# EAGLE design pc_kalam (EAGLE 6.4)
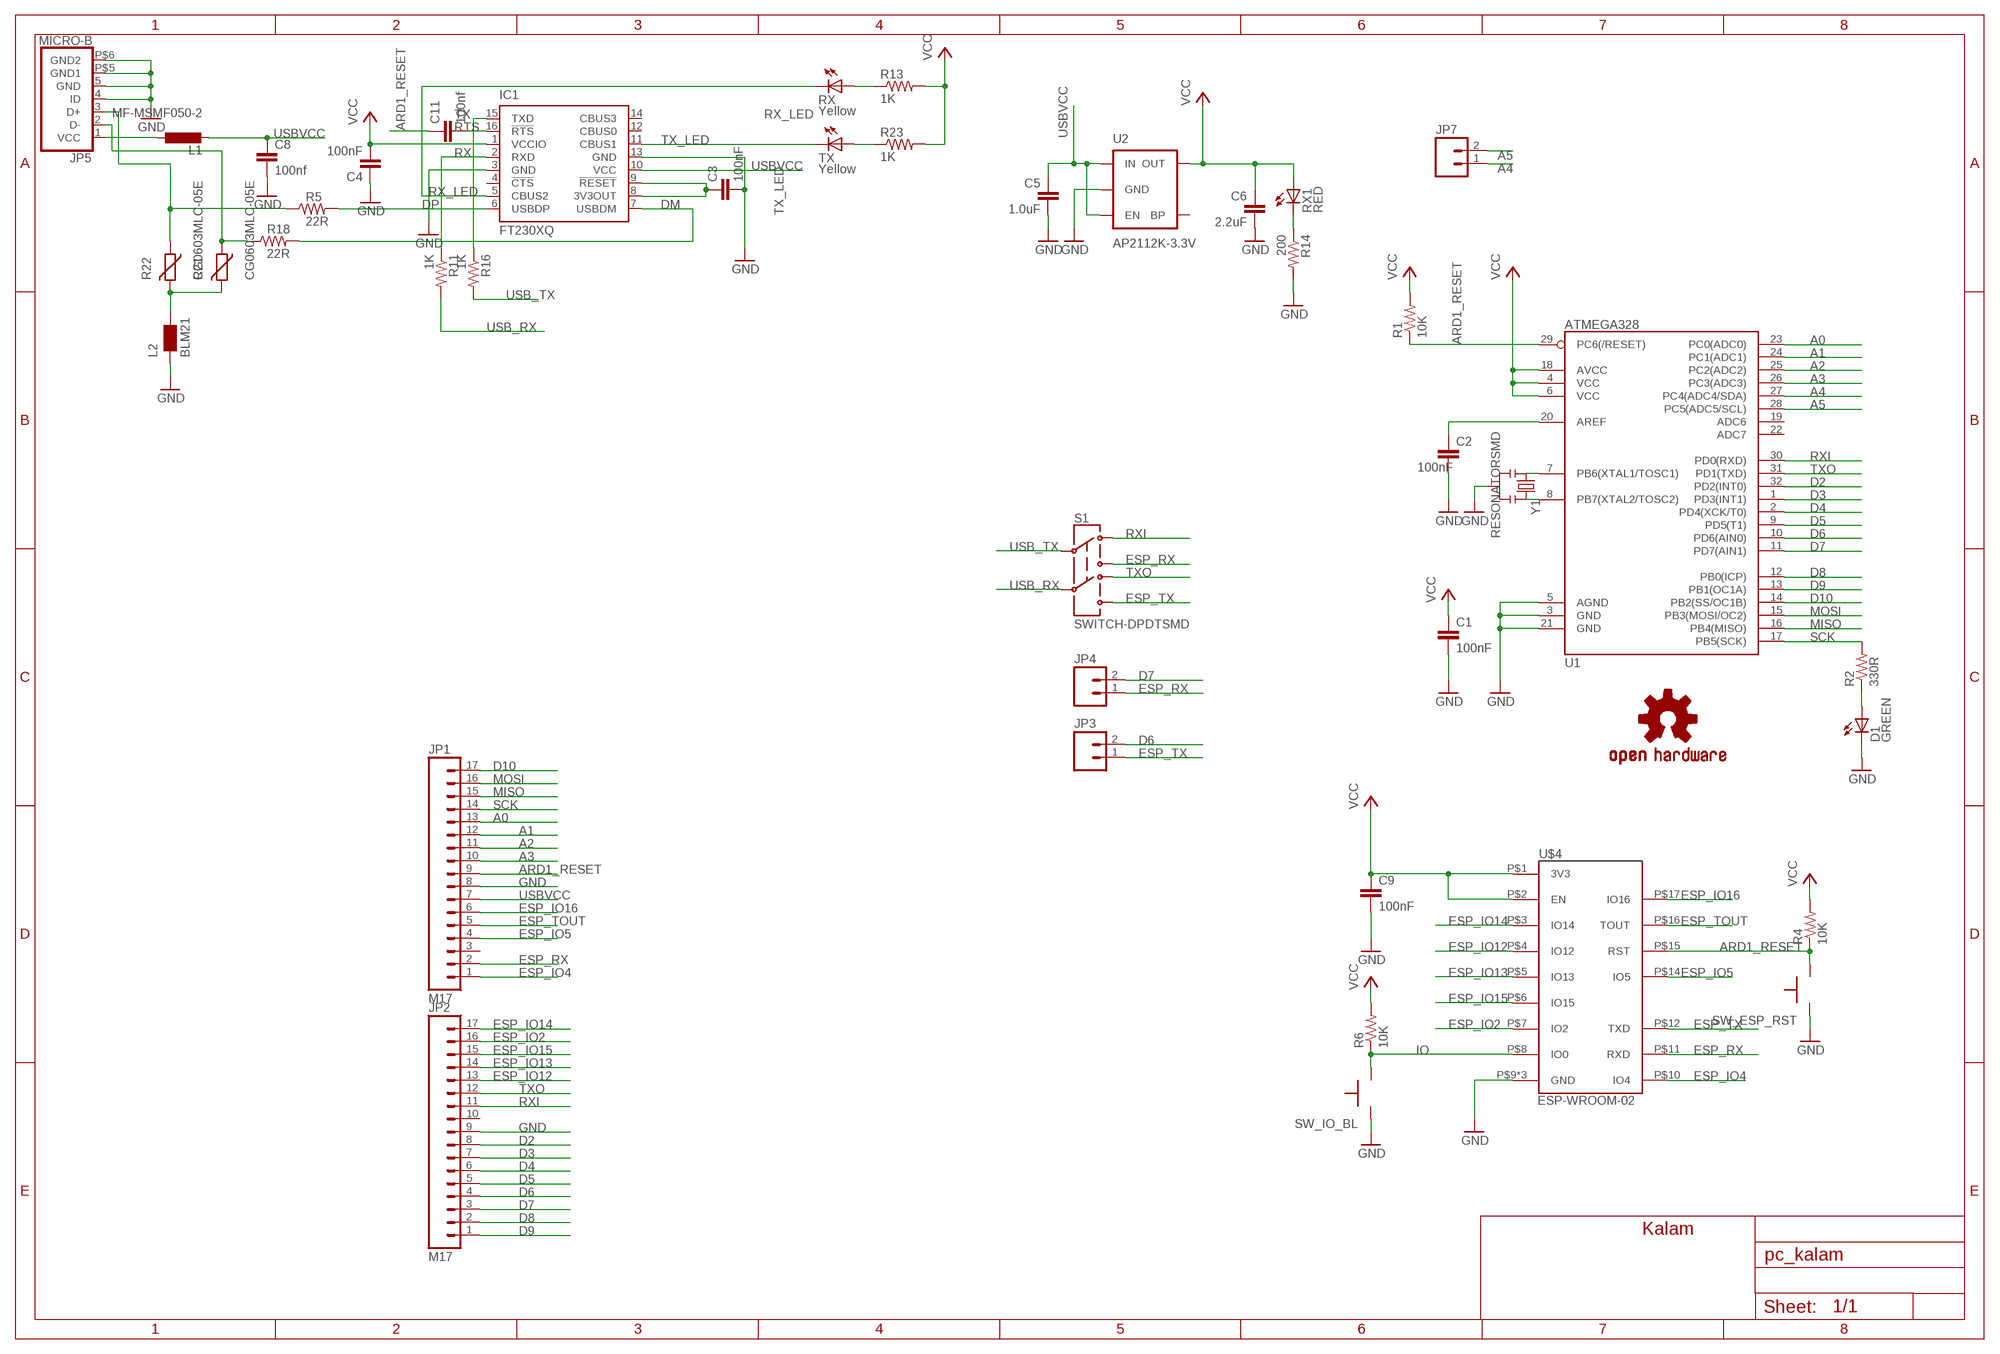
[diagram p0: schematic, sheet 1]

## Parts
C1  100nF  C-EUC0402  [C0402]
C2  100nF  C-EUC0402  [C0402]
C3  100nF  C-EUC0805  [C0805]
C4  100nF  C-EUC0805  [C0805]
C5  1.0uF  1.0UF-25V-+80/-20(0805)  [0805]
C6  2.2uF  C-EUC0805  [C0805]
C8  100nf  C-EUC0805  [C0805]
C9  100nF  C-EUC0402  [C0402]
C11  100nf  C-EUC0805  [C0805]
D1  GREEN  LED0603  [LED-0603]
IC1  FT230XQ  [QFN16]
JP1  M17  [1X17]
JP2  M17  [1X17]
JP3  M02PTH  [1X02]
JP4  M02PTH  [1X02]
JP5  MICRO-B  [MICRO-B]
JP7  M02PTH  [1X02]
L1  MF-MSMF050-2  L-EUL1812  [L1812]
L2  BLM21  WE-CBF_0805  [0805]
R1  10K  R-US_R0402  [R0402]
R2  330R  R-US_R0402  [R0402]
R4  10K  R-US_R0402  [R0402]
R5  22R  R-US_R0805  [R0805]
R6  10K  R-US_R0402  [R0402]
R11  1K  R-US_R0805  [R0805]
R13  1K  R-US_R0805  [R0805]
R14  200  R-US_R0805  [R0805]
R16  1K  R-US_R0805  [R0805]
R18  22R  R-US_R0805  [R0805]
R21  CG0603MLC-05E  VARISTORCN0603  [CT/CN0603]
R22  CG0603MLC-05E  VARISTORCN0603  [CT/CN0603]
R23  1K  R-US_R0805  [R0805]
RX  Yellow  LEDCHIPLED_0603  [CHIPLED_0603]
RX1  RED  LEDCHIPLED_0603  [CHIPLED_0603]
S1  SWITCH-DPDTSMD  [AYZ0202]
SW_ESP_RST  B3U-1000P  [B3U-1000P]
SW_IO_BL  B3U-1000P  [B3U-1000P]
TX  Yellow  LEDCHIPLED_0603  [CHIPLED_0603]
U1  ATMEGA328  ATMEGA168  [TQFP32-08]
U2  AP2112K-3.3V  V_REG_LDOSMD  [SOT23-5]
U$1  OSHW-LOGOS  [OSHW-LOGO-S]
U$2  PROTY-LOGO  [LOGO-PROTY]
U$3  PROTY-LOGO  [LOGO-PROTY]
U$4  ESP-WROOM-02  [ESP-WROOM-02]
U$5  KALAM  [KALAM]
Y1  RESONATORSMD  [RESONATOR-SMD]

## Nets
A0: JP1.13 U1.23(PC0(ADC0))
A1: JP1.12 U1.24(PC1(ADC1))
A2: JP1.11 U1.25(PC2(ADC2))
A3: JP1.10 U1.26(PC3(ADC3))
A4: JP7.1 U1.27(PC4(ADC4/SDA))
A5: JP7.2 U1.28(PC5(ADC5/SCL))
ARD1_RESET: C11.1 JP1.9 R1.1 R4.1 SW_ESP_RST.P$2 U1.29(PC6(/RESET)) U$4.P$15(RST)
D2: JP2.8 U1.32(PD2(INT0))
D3: JP2.7 U1.1(PD3(INT1))
D4: JP2.6 U1.2(PD4(XCK/T0))
D5: JP2.5 U1.9(PD5(T1))
D6: JP2.4 JP3.2 U1.10(PD6(AIN0))
D7: JP2.3 JP4.2 U1.11(PD7(AIN1))
D8: JP2.2 U1.12(PB0(ICP))
D9: JP2.1 U1.13(PB1(OC1A))
D10: JP1.17 U1.14(PB2(SS/OC1B))
DM: IC1.7(USBDM) R18.2
DP: IC1.6(USBDP) R5.2
ESP_IO2: JP2.16 U$4.P$7(IO2)
ESP_IO4: JP1.1 U$4.P$10(IO4)
ESP_IO5: JP1.4 U$4.P$14(IO5)
ESP_IO12: JP2.13 U$4.P$4(IO12)
ESP_IO13: JP2.14 U$4.P$5(IO13)
ESP_IO14: JP2.17 U$4.P$3(IO14)
ESP_IO15: JP2.15 U$4.P$6(IO15)
ESP_IO16: JP1.6 U$4.P$17(IO16)
ESP_RX: JP1.2 JP4.1 S1.3 U$4.P$11(RXD)
ESP_TOUT: JP1.5 U$4.P$16(TOUT)
ESP_TX: JP3.1 S1.6 U$4.P$12(TXD)
GND: C1.2 C2.2 C3.2 C4.1 C5.2 C6.2 C8.2 C9.2 D1.C IC1.3(GND) IC1.13(GND) JP1.8 JP2.9 JP5.4(ID) JP5.5(GND) JP5.P$5(GND1) JP5.P$6(GND2) L2.1 R14.2 SW_ESP_RST.P$1 SW_IO_BL.P$1 U1.3(GND) U1.5(AGND) U1.21(GND) U2.2(GND) U$4.P$9(GND) U$4.P$13(GND) U$4.P$18(GND) Y1.2
IO: R6.1 SW_IO_BL.P$2 U$4.P$8(IO0)
MISO: JP1.15 U1.16(PB4(MISO))
MOSI: JP1.16 U1.15(PB3(MOSI/OC2))
N$1: C2.1 U1.20(AREF)
N$2: U1.8(PB7(XTAL2/TOSC2)) Y1.3
N$3: U1.7(PB6(XTAL1/TOSC1)) Y1.1
N$4: C3.1 IC1.8(3V3OUT) IC1.9(!RESET)
N$7: R14.1 RX1.C
N$8: D1.A R2.1
N$16: JP5.2(D-) R18.1 R21.1
N$18: JP5.1(VCC) L1.1
N$40: R13.1 RX.A
N$41: R23.1 TX.A
N$64: L2.2 R21.2 R22.2
N$73: JP5.3(D+) R5.1 R22.1
RTS: C11.2 IC1.16(!RTS)
RX: IC1.2(RXD) R11.1
RX_LED: IC1.5(CBUS2) RX.C
RXI: JP2.11 S1.1 U1.30(PD0(RXD))
SCK: JP1.14 R2.2 U1.17(PB5(SCK))
TX: IC1.15(TXD) R16.1
TX_LED: IC1.11(CBUS1) TX.C
TXO: JP2.12 S1.4 U1.31(PD1(TXD))
USB_RX: R11.2 S1.5
USB_TX: R16.2 S1.2
USBVCC: C5.1 C8.1 IC1.10(VCC) JP1.7 L1.2 U2.1(IN) U2.3(EN)
VCC: C1.1 C4.2 C6.1 C9.1 IC1.1(VCCIO) R1.2 R4.2 R6.2 R13.2 R23.2 RX1.A U1.4(VCC) U1.6(VCC) U1.18(AVCC) U2.5(OUT) U$4.P$1(3V3) U$4.P$2(EN)
Unconnected: IC1.4(!CTS) IC1.12(CBUS0) IC1.14(CBUS3) JP1.3 JP2.10 U1.19(ADC6) U1.22(ADC7) U2.4(BP)

## Library data of the parts
C1-C4 C6 C8 C9 C11 = rcl:C-EU: CAPACITOR, European symbol
C5 = SparkFun-Capacitors:1.0UF-25V-+80/-20(0805): CAP-11625; PROD_ID: CAP-11625
D1 = SparkFun:LED: LEDs Standard schematic elements and footprints for 5mm, 3mm, 1206, and 0603 sized LEDs. 5mm - Spark Fun Electronics SKU : COM-00529 (and others)
IC1 = ftdichip:FT230X: USB to BASIC UART IC Auto generated by make-symbol-device-package-bsdl.ulp Rev. 43 Source: Data sheet <http://www.ftdichip.com/Support/Documents/DataSheets/ICs/DS_FT230X.pdf>
JP1 JP2 = SparkFun:M17
JP3 JP4 JP7 = SparkFun:M02: Header 2 Standard 2-pin 0.1" header. Use with straight break away headers (SKU : PRT-00116), right angle break away headers (PRT-00553), swiss pins (PRT-00743), machine pins (PRT-00117), and female headers (PRT-00115). Molex polarized connector foot print use with SKU : PRT-08233 with associated crimp pins and housings.
JP5 = circuitects:MICRO-B
L1 = rcl:L-EU: INDUCTOR, European symbol
L2 = wuerth-elektronik:WE-CBF: SMD EMI Suppression Ferrite Beads - excellent anti-EMI properties - low DCR - impedances till 3000 ohms - rated current up to 6 A
R1 R2 R4-R6 R11 R13 R14 R16 R18 R23 = rcl:R-US_: RESISTOR, American symbol
R21 R22 = varistor:VARISTOR: VARISTOR
RX RX1 TX = led:LED: LED OSRAM: - CHIPLED LG R971, LG N971, LY N971, LG Q971, LY Q971, LO R971, LY R971 LH N974, LH R974 LS Q976, LO Q976, LY Q976 LO Q996 - Hyper CHIPLED LW Q18S LB Q993, LB Q99A, LB R99A - SideLED LS A670, LO A670, LY A670, LG A670, LP A670 LB A673, LV A673, LT A673, LW A673 LH A674 LY A675 LS A676, LA A676, LO A676, LY A676, LW A676 LS A679, LY A679, LG A679 - Hyper Micro SIDELED® LS Y876, LA Y876, LO Y876, LY Y876 LT Y87S - SmartLED LW L88C, LW L88S LB L89C, LB L89S, LG L890 LS L89K, LO L89K, LY L89K LS L896, LA L896, LO L896, LY L896 - TOPLED LS T670, LO T670, LY T670, LG T670, LP T670 LSG T670, LSP T670, LSY T670, LOP T670, LYG T670 LG T671, LOG T671, LSG T671 LB T673, LV T673, LT T673, LW T673 LH T674 LS T676, LA T676, LO T676, LY T676, LB T676, LH T676, LSB T676, LW T676 LB T67C, LV T67C, LT T67C, LS T67K, LO T67K, LY T67K, LW E67C LS E67B, LA E67B, LO E67B, LY E67B, LB E67C, LV E67C, LT E67C LW T67C LS T679, LY T679, LG T679 LS T770, LO T770, LY T770, LG T770, LP T770 LB T773, LV T773, LT T773, LW T773 LH T774 LS E675, LA E675, LY E675, LS T675 LS T776, LA T776, LO T776, LY T776, LB T776 LHGB T686 LT T68C, LB T68C - Hyper Mini TOPLED® LB M676 - Mini TOPLED Santana® LG M470 LS M47K, LO M47K, LY M47K Source: http://www.osram.convergy.de LUXEON: - LUMILED® LXK2-PW12-R00, LXK2-PW12-S00, LXK2-PW14-U00, LXK2-PW14-V00 LXK2-PM12-R00, LXK2-PM12-S00, LXK2-PM14-U00 LXK2-PE12-Q00, LXK2-PE12-R00, LXK2-PE12-S00, LXK2-PE14-T00, LXK2-PE14-U00 LXK2-PB12-K00, LXK2-PB12-L00, LXK2-PB12-M00, LXK2-PB14-N00, LXK2-PB14-P00, LXK2-PB14-Q00 LXK2-PR12-L00, LXK2-PR12-M00, LXK2-PR14-Q00, LXK2-PR14-R00 LXK2-PD12-Q00, LXK2-PD12-R00, LXK2-PD12-S00 LXK2-PH12-R00, LXK2-PH12-S00 LXK2-PL12-P00, LXK2-PL12-Q00, LXK2-PL12-R00 Source: www.luxeon.com KINGBRIGHT: KA-3528ASYC Source: www.kingbright.com
S1 = SparkFun:SWITCH-DPDT: DPDT Version of the COM-00597
SW_ESP_RST SW_IO_BL = circuitects:B3U-1000P
U1 = SparkFun:ATMEGA168
U2 = SparkFun-PowerIC:V_REG_LDO: Voltage Regulator LDO Standard 150mA LDO voltage regulator in SOT-23 layout. Micrel part MIC5205. BP (by-pass) pin is used to lower output noise with 470pF cap.; PROD_ID: VREG-12457
U$1 = SparkFun:OSHW-LOGO: Open Source Hardware Logo This logo indicates the piece of hardware it is found on incorporates a OSHW license and/or adheres to the definition of open source hardware found here: http://freedomdefined.org/OSHW
U$2 U$3 = circuitects:PROTY-LOGO
U$4 = esp8266:ESP-WROOM-02
U$5 = circuitects:KALAM
Y1 = SparkFun:RESONATOR: Resonator Small SMD resonator. This is the itty bitty 10/20MHz resonators with built in caps. CSTCE10M0G55 and CSTCE20M0V53. Footprint has been reviewed closely but hasn't been tested yet.

## Board
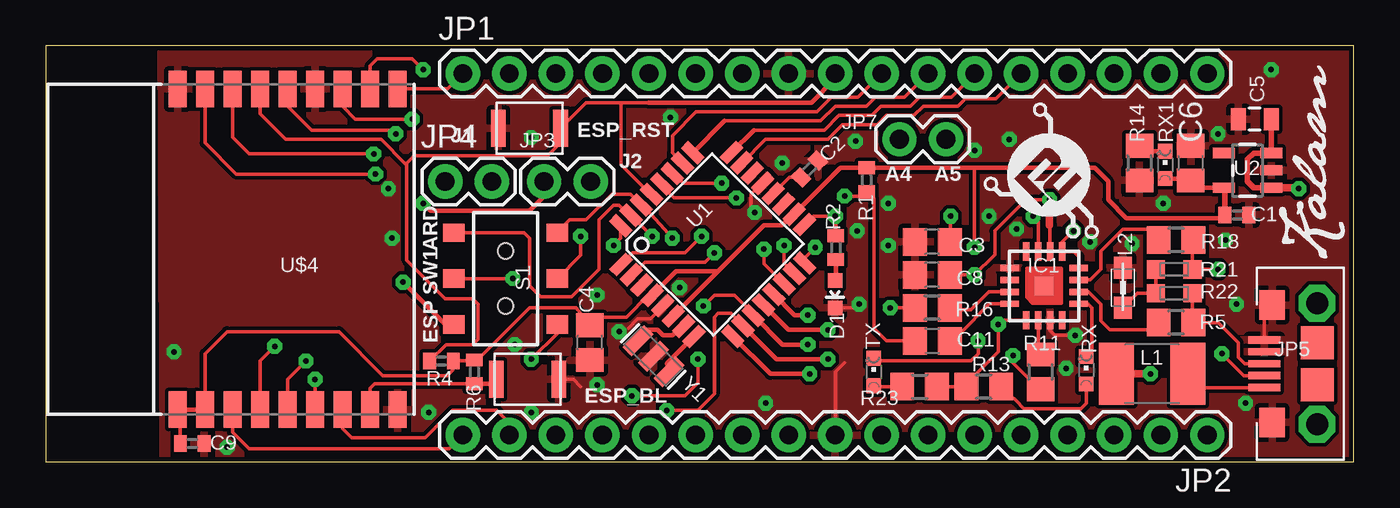
[diagram p1: board, top side]
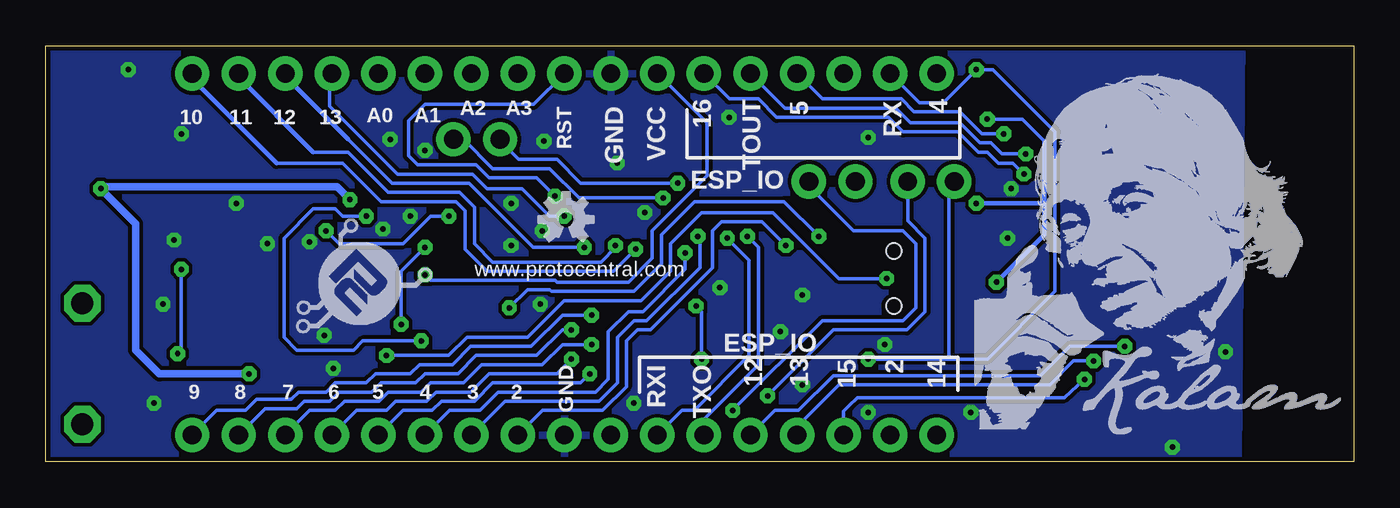
[diagram p2: board, bottom side, seen from below]

Size 71.4 x 22.7 mm. Coordinates in mm from the lower left corner, seen from the top.
Outline: 0,0 71.4,0 71.4,22.7 0,22.7 0,0
Copper layers (1*2*15*16): Top 0.035mm / dielectric 1.5mm / Route2 0.035mm / dielectric 0.15mm / Route15 0.035mm / dielectric 0.2mm / Bottom 0.035mm
Design rules "Circuitects-Rules-8mil": minimum track width 6mil, minimum drill 0.3mm, track to track 8mil, track to pad 8mil, pad to pad 8mil, via to via 8mil, smd to smd 8mil, copper to edge 10mil, drill to drill 8mil, minimum pad ring 12mil, minimum via ring 10mil, stop-mask expansion 4mil, vias tented up to drill 25mil, thermal gap 10mil

### Footprints (pad centres in the part's own frame; a part is rotated, then mirrored left to right if it is on the bottom)
C0402 = smd 0.7 x 0.9: 1 -0.65,0; 2 0.65,0
C0805 = smd 1.3 x 1.5: 1 -0.95,0; 2 0.95,0
0805 = smd 0.8 x 1.2: 1 -0.9,0; 2 0.9,0
LED-0603 = smd 0.8 x 0.8: A 0,-0.75; C 0,0.75
QFN16 = smd 1 x 0.35: 1 -1.875,0.975; 2 -1.875,0.325; 3 -1.875,-0.325; 4 -1.875,-0.975; 9 1.875,-0.975; 10 1.875,-0.325; 11 1.875,0.325; 12 1.875,0.975 | smd 0.35 x 1: 5 -0.975,-1.875; 6 -0.325,-1.875; 7 0.325,-1.875; 8 0.975,-1.875; 13 0.975,1.875; 14 0.325,1.875; 15 -0.325,1.875; 16 -0.975,1.875 | smd 1 x 1: TAB 0,0
1X17 = drill 1.016 pad 1.88: 1 0,0; 2 2.54,0; 3 5.08,0; 4 7.62,0; 5 10.16,0; 6 12.7,0; 7 15.24,0; 8 17.78,0; 9 20.32,0; 10 22.86,0; 11 25.4,0; 12 27.94,0; 13 30.48,0; 14 33.02,0; 15 35.56,0; 16 38.1,0; 17 40.64,0
1X02 = drill 1.016 pad 1.88: 1 0,0; 2 2.54,0
MICRO-B = smd 0.4 x 1.75: 1 -1.25,2.975; 2 -0.6,2.975; 3 0.05,2.975; 4 0.7,2.975; 5 1.35,2.975 | smd 1.8 x 1.8: P$1 -1.1,0.1; P$2 1.2,0.1 | drill 1.2 pad 2 octagon: P$3 -3.25,0.1; P$4 3.35,0.1 | smd 1.6 x 1.4: P$5 -3.15,2.55; P$6 3.25,2.55
L1812 = smd 1.9 x 3.4: 1 -1.95,0; 2 1.95,0
0805' = smd 1.2 x 1: 1 -1.1,0; 2 1.1,0
R0402 = smd 0.7 x 0.9: 1 -0.65,0; 2 0.65,0
R0805 = smd 1.3 x 1.5: 1 -0.95,0; 2 0.95,0
CT/CN0603 = smd 1 x 1: 1 -1,0; 2 1,0
CHIPLED_0603 = smd 0.8 x 0.8: A 0,-0.75; C 0,0.75
AYZ0202 = smd 1 x 1.15: 1 -2.5,2.825; 2 0,2.825; 3 2.5,2.825; 4 -2.5,-2.825; 5 0,-2.825; 6 2.5,-2.825 | hole 0.85: 1.5,0; -1.5,0
B3U-1000P = smd 0.8 x 2: P$1 -1.7,0; P$2 1.7,0
TQFP32-08 = smd 1.27 x 0.559: 1 -4.293,2.8; 2 -4.293,2; 3 -4.293,1.2; 4 -4.293,0.4; 5 -4.293,-0.4; 6 -4.293,-1.2; 7 -4.293,-2; 8 -4.293,-2.8; 17 4.293,-2.8; 18 4.293,-2; 19 4.293,-1.2; 20 4.293,-0.4; 21 4.293,0.4; 22 4.293,1.2; 23 4.293,2; 24 4.293,2.8 | smd 0.559 x 1.27: 9 -2.8,-4.293; 10 -2,-4.293; 11 -1.2,-4.293; 12 -0.4,-4.293; 13 0.4,-4.293; 14 1.2,-4.293; 15 2,-4.293; 16 2.8,-4.293; 25 2.8,4.293; 26 2,4.293; 27 1.2,4.293; 28 0.4,4.293; 29 -0.4,4.293; 30 -1.2,4.293; 31 -2,4.293; 32 -2.8,4.293
SOT23-5 = smd 0.55 x 1.2: 1 -0.95,-1.3; 2 0,-1.3; 3 0.95,-1.3; 4 0.95,1.3; 5 -0.95,1.3
ESP-WROOM-02 = smd 2 x 0.99: P$1 -8.75,2.9; P$2 -8.75,1.4; P$3 -8.75,-0.1; P$4 -8.75,-1.6; P$5 -8.75,-3.1; P$6 -8.75,-4.6; P$7 -8.75,-6.1; P$8 -8.75,-7.6; P$9 -8.75,-9.1; P$10 8.75,-9.1; P$11 8.75,-7.6; P$12 8.75,-6.1; P$13 8.75,-4.6; P$14 8.75,-3.1; P$15 8.75,-1.6; P$16 8.75,-0.1; P$17 8.75,1.4; P$18 8.75,2.9
RESONATOR-SMD = smd 0.7 x 1.7: 1 -1.2,0; 2 0,0; 3 1.2,0

### Placement (x,y rotation side)
C1  65.02,13.47 0 top
C2  41.69,15.98 45 top
C3  48.4,12 180 top
C4  29.7,6.5 90 top
C5  66,18.7 180 top
C6  62.5,16.3 90 top
C8  48.4,10.2 180 top
C9  8,1 0 top
C11  48.4,6.6 0 top
D1  43.09,9.15 180 top
IC1  54.5,9.6 90 top
JP1  22.77,21.18 0 top
JP2  63.41,1.46 180 top
JP3  27.2,15.3 0 top
JP4  21.8,15.3 0 top
JP5  69.5,5.3 90 top
JP7  46.6,17.6 0 top
L1  60.4,4.8 180 top
L2  BLM21  [0805']  58.8,9.5 270 top
R1  44.81,15.39 90 top
R2  43.13,11.69 90 top
R4  21.6,5.5 0 top
R5  61.7,7.6 180 top
R6  23.4,4.9 90 top
R11  54.3,4.9 270 top
R13  51.2,4.1 180 top
R14  59.7,16.3 270 top
R16  48.4,8.4 180 top
R18  61.7,12.1 180 top
R21  61.6,10.5 180 top
R22  61.6,9.2 180 top
R23  47.7,4.1 0 top
RX  56.8,5 0 top
RX1  61.1,16.2 0 top
S1  25.1,10 270 top
SW_ESP_RST  26.4,18.2 0 top
SW_IO_BL  26.3,4.5 180 top
TX  45.2,4.9 0 top
U1  36.41,11.86 45.4 top
U2  65.6,15.9 90 top
U$1  43,13.22 0 bottom
U$2  57.59,12.1 90 top
U$3  57.8,6.9 0 bottom
U$4  10.1,11.6 90 top
U$5  20.7,1.5 0 bottom
U$6  [KALAM-NAME-ONLY]  70.9,11 90 top
Y1  33.17,5.75 315.2 top

### Tracks (layer width: path | path; a pad name or v marks a point on that pad's centre or on a via)
A0
  Top 0.2: U1.23 38.02,16.32 39.3,17.6 42.7,17.6 43.5,18.4 45.4,18.4 45.9,18.9 47.4,18.9 47.9,19.4 49.8,19.4 50.2,19.8 51.87,19.8 JP1.13
A1
  Top 0.2: 38.65,18.1 42.5,18.1 43.3,18.9 45.1,18.9 45.6,19.4 47.2,19.4 47.7,19.9 49.42,19.9 JP1.12
  Top 0.254: 37.24,16.88 U1.24 38.65,18.1
A2
  Top 0.2: 37.05,18.6 42.3,18.6 43.1,19.4 44.8,19.4 45.3,19.9 46.88,19.9 JP1.11
  Top 0.254: 37.05,18.6 U1.25
A3
  Top 0.2: U1.26 34.2,16.86 34.2,17.8 35.5,19.1 42.1,19.1 42.9,19.9 44.34,19.9 JP1.10
A4  (via drill 0.3)
  Top 0.2: 34.2,15.7 34.3,15.7 34.8,15.2 v36.9,15.2
  Top 0.254: U1.27 34.2,15.7
  Bottom 0.2: v36.9,15.2 42.2,15.2 43.5,16.5 45.6,16.5 46.6,17.5 JP7.1
A5  (via drill 0.3)
  Top 0.2: U1.28 33.64,15.06 34.3,14.4 v37.7,14.4
  Top 0.254: U1.28
  Bottom 0.2: v37.7,14.4 42.3,14.4 43.9,16 47,16 48.6,17.6 JP7.2
ARD1_RESET  (via drill 0.3)
  Top 0.2: v43.6,14.5 44.5,14.5 44.61,14.61 44.81,14.61 R1.1 45.2,14.35 45.2,7.3 45.9,6.6 C11.1 | 32.9,19.6 31.4,19.6 | 31.4,19.6 29.5,19.6 SW_ESP_RST.P$2 28.1,17.4 27.4,16.7 20.1,16.7 19.65,16.25 | U1.29 33.01,14.59 31.4,16.2 31.4,19.6 | R4.1 21.85,6.4 23.3,6.4 23.6,6.7 23.6,8.6 23.3,8.9 21.8,8.9 19.7,11 19.7,16.2 19.65,16.25 | U$4.P$15 11.7,19 13.1,17.6 18.3,17.6 19.65,16.25
  Top 0.254: JP1.9 43.09,20.89 41.8,19.6 32.9,19.6
  Bottom 0.2: v43.6,14.5 44.6,15.5 47.2,15.5 47.9,16.2 51.1,16.2 51.6,16.7 51.6,18.6 50.7,19.5 44.77,19.5 JP1.9
D2  (via drill 0.3)
  Top 0.2: U1.32 31.39,12.19 v31,11.8
  Bottom 0.2: JP2.8 44.28,2.8 41,2.8 39.7,4.1 39.7,6.6 39.1,7.2 38.4,7.2 35,10.6 35,12.6 34.5,13.1 32.3,13.1 v31,11.8
D3  (via drill 0.3)
  Top 0.2: 31.4,10.8 U1.1 32.03,11.4 34.9,11.4 v35.8,12.3
  Bottom 0.2: v35.8,12.3 35.7,12.2 35.7,10.6 38.6,7.7 39.3,7.7 40.2,6.8 40.2,4.3 41.2,3.3 46.33,3.3 JP2.7
D4  (via drill 0.3)
  Top 0.2: U1.2 32.01,10.21 32.7,10.9 36,10.9 v36.5,11.4
  Bottom 0.2: JP2.6 49.37,2.8 47.7,2.8 46.7,3.8 41.4,3.8 40.7,4.5 40.7,7.1 39.6,8.2 38.8,8.2 36.5,10.5 v36.5,11.4
D5  (via drill 0.3)
  Top 0.254: v41.7,4.8 39.55,4.8 U1.9
  Bottom 0.2: v41.7,4.8 42.2,4.3 47,4.3 48,3.3 49.8,3.3 50.3,2.8 51.91,2.8 JP2.5
D6  (via drill 0.3)
  Top 0.2: U1.10 38.06,7.44 37.4,8.1 36.7,8.1 36.5,7.9 36.5,3.7 35.6,2.8 v33.9,2.8
  Top 0.254: v42.7,5.6 39.88,5.6 U1.10
  Bottom 0.2: v42.7,5.6 43.5,4.8 47.2,4.8 48.2,3.8 50.1,3.8 50.6,3.3 52.3,3.3 52.8,2.8 54.45,2.8 JP2.4 | JP3.2 29.74,15.04 27.3,12.6 24.6,12.6 23.9,11.9 23.9,8.4 24.6,7.7 29,7.7 v33.9,2.8
D7  (via drill 0.3)
  Top 0.2: U1.11 38.62,8.08 37.6,9.1 36.5,9.1 v35.9,8.5 | v35.6,5.6 35.6,4.3 34.9,3.6 v32,3.6
  Top 0.254: U1.11 40.22,6.4 v41.6,6.4
  Bottom 0.2: v41.6,6.4 43.2,6.4 44.3,5.3 47.6,5.3 48.6,4.3 50.4,4.3 50.9,3.8 52.7,3.8 53.2,3.3 55.1,3.3 55.6,2.8 56.98,2.8 JP2.3 | v35.6,5.6 35.6,8.2 v35.9,8.5 | JP4.2 24.34,13.14 23.4,12.2 23.4,8.2 24.4,7.2 28.4,7.2 v32,3.6
D8  (via drill 0.3)
  Top 0.254: v42.7,7.2 40.55,7.2 U1.12
  Bottom 0.2: v42.7,7.2 43.2,7.2 44.6,5.8 47.9,5.8 48.9,4.8 50.7,4.8 51.2,4.3 53.1,4.3 53.6,3.8 55.4,3.8 55.9,3.3 57.3,3.3 57.7,2.9 59.42,2.9 JP2.2
D9  (via drill 0.3)
  Top 0.254: v41.6,8 40.88,8 U1.13
  Bottom 0.2: v41.6,8 43.2,8 44.9,6.3 48.2,6.3 49.2,5.3 51,5.3 51.5,4.8 53.4,4.8 53.9,4.3 55.6,4.3 56.1,3.8 57.6,3.8 58,3.4 59.9,3.4 60.5,2.8 62.06,2.8 JP2.1
D10  (via drill 0.3)
  Top 0.2: v39.2,11.6 39.2,10.81 U1.14
  Bottom 0.2: 58.8,16.3 55.2,16.3 53.1,14.2 49,14.2 48.5,13.7 48.5,11.6 47.3,10.4 40.4,10.4 v39.2,11.6
  Bottom 0.254: JP1.17 63.41,20.91 58.8,16.3
DM
  Top 0.2: R18.2 60.75,12.15 60.2,12.7 58.8,12.7 57.6,11.5 57.6,10.5 57.02,9.93 IC1.7
DP
  Top 0.2: IC1.6 56.92,9.28 57.6,8.6 57.6,7.7 58.1,7.2 60.2,7.2 60.6,7.6 R5.2
ESP_IO2
  Top 0.2: JP2.16 25.31,2.09 24.6,2.8 22.2,2.8 20.7,1.3 16.7,1.3 16.2,1.8 U$4.P$7
ESP_IO4
  Top 0.2: U$4.P$10 21.93,20.35 JP1.1
ESP_IO5  (via drill 0.3)
  Top 0.2: U$4.P$14 13.2,19.4 14.5,18.1 18.9,18.1 v19.1,17.9
  Bottom 0.2: JP1.4 29,19.8 24.7,19.8 24,19.1 21.5,19.1 20.3,17.9 v19.1,17.9
ESP_IO12  (via drill 0.3)
  Top 0.2: U$4.P$4 11.7,5.5 v12.5,6.3
  Bottom 0.2: JP2.13 31.59,2.8 30.3,2.8 28.4,4.7 17.1,4.7 16.05,5.75 15.8,6 15.5,6.3 v12.5,6.3
ESP_IO13  (via drill 0.3)
  Top 0.2: U$4.P$5 13.2,4.5 v14.2,5.5
  Bottom 0.2: JP2.14 30.39,1.91 28.1,4.2 16.6,4.2 15.3,5.5 v14.2,5.5
ESP_IO14
  Top 0.2: 22.75,1.46 JP2.17 22.02,0.7 11.1,0.7 10.2,1.6 U$4.P$3
ESP_IO15  (via drill 0.3)
  Top 0.2: U$4.P$6 v14.7,4.5
  Bottom 0.2: v14.7,4.5 15.8,3.5 27.1,3.5 27.55,3.05 27.6,3 27.85,2.75 JP2.15
ESP_IO16  (via drill 0.3)
  Top 0.2: U$4.P$17 8.7,17.4 10.4,15.7 v18,15.7
  Bottom 0.2: JP1.6 34.09,19.8 32.5,19.8 31.5,18.8 25.4,18.8 24.6,18 21.6,18 20.5,16.9 20,16.9 19.4,16.3 18.6,16.3 v18,15.7
ESP_RX  (via drill 0.3)
  Top 0.2: S1.3 27.93,7.03 v26.5,5.6 | U$4.P$11 17.7,21.6 18.1,22 20,22 v20.6,21.4
  Bottom 0.2: JP1.2 25.29,21.18 23.7,19.6 22.4,19.6 v20.6,21.4 19.7,21.4 16.3,18 16.3,9.3 20,5.6 22.1,5.6 | 22.1,5.6 v26.5,5.6 | JP4.1 22.1,15 22.1,5.6
ESP_TOUT  (via drill 0.3)
  Top 0.2: U$4.P$16 10.2,17.7 11.1,16.8 v17.9,16.8
  Bottom 0.2: JP1.5 31.05,19.3 25,19.3 24.2,18.5 21.5,18.5 20.4,17.4 19.8,17.4 19.2,16.8 v17.9,16.8
ESP_TX  (via drill 0.3)
  Top 0.2: U$4.P$12 16.2,19.4 16.9,18.7 v20,18.7
  Top 0.254: JP3.1 27.2,14.5 26.4,13.7 21,13.7 v20.6,14.1 | S1.6 21.8,7.5 v19.5,9.8
  Bottom 0.2: v20,18.7 18.1,18.7 16.9,17.5
  Bottom 0.254: 16.9,17.5 16.9,14.1 | 16.9,14.1 16.9,12.4 v19.5,9.8 | v20.6,14.1 16.9,14.1
GND  (via drill 0.3)
  Top 0.2: U1.5 33.68,8.48 33,7.8 32.3,7.8 31.8,7.3 | JP2.9 43.1,1.7 43.1,4.9 43.6,5.4 | D1.C 44.2,8.4 v44.4,8.6 | SW_IO_BL.P$1 28.8,4.5 29.2,4.1 | U1.21 39.1,15.2 38.5,14.6 38.5,13.8 v38.7,13.6 | JP5.5 66.53,8.12 JP5.P$6 | IC1.3 54.83,7.17 55.1,6.9 v56.2,6.9
  Top 0.254: Y1.2 33.05,5.85
  other vias: 34.6,9.5 61,14.1 20.9,2.7 7,6 30.1,4.2 30.1,9.1 39.3,3.2 40.2,16.3 46,11.8 64.4,12.1 34.1,18.8 65,8.6 44.2,17.5 64,17.9 66.9,21.4 18.9,12.2 59.3,11.9 51.5,13.4 52.6,17.6 9.9,0.8 53,12.7 65.5,3.2 55.7,5.1 26.5,17.7 18.7,14.9 44.3,12.6 57,12 46,14.1 25.6,6.4 31.3,7.1 26.5,2.7 50.7,17
  pour Top: 6.3,23.2 71.4,22.8 71.4,-0.4 6.4,0
  pour Bottom: 6.1,23.3 71.4,22.9 71.4,-0.4 6.3,0
IO
  Top 0.2: R6.1 17.95,4.25 17.7,4 U$4.P$8
  Top 0.254: R6.1 24.35,4.25 SW_IO_BL.P$2
MISO  (via drill 0.3)
  Top 0.2: U1.16 41.43,11.13 v42,11.7
  Bottom 0.2: 54.9,17.6 52.5,15.2 48.3,15.2 44.8,11.7 v42,11.7
  Bottom 0.254: JP1.15 58.25,20.95 54.9,17.6
MOSI  (via drill 0.3)
  Top 0.2: v40.3,11.8 40.3,10.84 U1.15
  Top 0.254: U1.15 40.73,10.27
  Bottom 0.2: 56.8,16.9 54.9,16.9 52.7,14.7 48.8,14.7 48,13.9 48,11.9 47,10.9 41.1,10.9 40.3,11.7 v40.3,11.8
  Bottom 0.254: JP1.16 60.85,20.95 56.8,16.9
N$1
  Top 0.2: C2.1 40.59,15.52 U1.20
N$2
  Top 0.254: Y1.3 33.92,5.37 U1.8
N$3
  Top 0.254: U1.7 34.7,7.4 34.2,6.9 33.7,6.9 33.4,7.2 32.72,7.2 Y1.1
N$4  (via drill 0.3)
  Top 0.2: v56.1,12.6 55.48,11.97 IC1.9 56.12,11.47 56.4,11.2 56.4,10.6 IC1.8 | C3.1 v49.4,13.4
  Bottom 0.2: v56.1,12.6 55.4,11.9 51.9,11.9 50.4,13.4 v49.4,13.4
N$7
  Top 0.254: RX1.C 60,16.95 R14.1
N$8
  Top 0.254: R2.1 43.13,9.74 D1.A
N$16  (via drill 0.3)
  Top 0.2: R18.1 62.6,12.05 R21.1 v64,10.5 | JP5.2 65.4,4.7 v64.2,5.9
  Bottom 0.2: v64,10.5 64,6.1 v64.2,5.9
N$18
  Top 0.2: 62.45,4.7 L1.1 63.1,4.05 JP5.1
N$40
  Top 0.2: R13.1 52.95,3.35 53.4,2.9 56.5,2.9 56.8,3.2 RX.A
N$41
  Top 0.2: R23.1 45.25,4.1 TX.A
N$64
  Top 0.2: R21.2 R22.2 59.6,9.2 L2.2
N$73
  Top 0.2: R22.1 62.6,7.65 R5.1 | 62.8,7.75 R5.1 | JP5.3 65.45,5.35 65.1,5.7 65.1,6.5 64,7.6 R5.1
RTS
  Top 0.2: IC1.16 51.52,8.62 49.9,7 49.75,7 C11.2
RX
  Top 0.2: IC1.2 54.17,6.17 R11.1
RX_LED
  Top 0.2: IC1.5 56.88,8.62 57.1,8.4 57.1,6.05 RX.C
RXI  (via drill 0.3)
  Top 0.2: v34.2,12.2 32.58,14.02 U1.30 31.93,14.6 30.9,14.6 29.5,13.2 28.6,13.2 27.93,12.53 S1.1
  Bottom 0.2: v34.2,12.2 33,11 33,5.8 36,2.8 36.66,2.8 JP2.11
SCK  (via drill 0.3)
  Top 0.2: U1.17 41.45,12.95 41.9,13.4 v43.1,13.4
  Top 0.254: U1.17 41.42,12.92 | R2.2 43.1,12.57 v43.1,13.4
  Bottom 0.2: JP1.14 55.9,21.07 55.9,19.4 52.2,15.7 48.1,15.7 47.3,14.9 45.4,14.9 43.9,13.4 v43.1,13.4
TX
  Top 0.2: 49.45,8.5 R16.1 49.45,8.3 50.5,8.3 51.48,9.28 IC1.15
TX_LED  (via drill 0.3)
  Top 0.2: IC1.11 54.17,13.12 v53.9,13.4 | TX.C 45.45,5.65 45.6,5.5 50.5,5.5 50.9,5.9 v50.9,6.6
  Bottom 0.2: v50.9,6.6 54.1,6.6 54.6,6.1 57.7,6.1 58.4,6.8 58.4,12.2 56.8,13.8 55.6,13.8 55.2,13.4 v53.9,13.4
TXO  (via drill 0.3)
  Top 0.2: v33.1,12.3 U1.31 31.85,13.45 31.3,14 31,14 30.2,13.2 30.2,10.5 28.7,9 27,9 26.4,9.6 26.4,12.2 26.1,12.5 S1.4
  Bottom 0.2: v33.1,12.3 32.5,11.7 32.5,5.3 35.47,2.33 JP2.12
USB_RX  (via drill 0.3)
  Top 0.2: S1.5 v25.5,10 | R11.2 53.95,4.25 52.8,5.4 v52.8,5.8
  Bottom 0.2: v25.5,10 28.1,10 31.7,13.6 35.6,13.6 37.3,11.9 37.3,10.4 38.9,8.8 43.1,8.8 45.1,6.8 48.4,6.8 49.4,5.8 v52.8,5.8
USB_TX  (via drill 0.3)
  Top 0.2: v29.2,12.3 29.2,11.28 S1.2 | R16.2 v46.1,8.4
  Bottom 0.2: v46.1,8.4 45.1,9.4 43.9,9.4 43.8,9.3 39.3,9.3 37.8,10.8 37.8,12.4 36,14.2 31.1,14.2 v29.2,12.3
USBVCC  (via drill 0.3)
  Top 0.2: IC1.10 54.83,12.88 54.8,12.9 | C8.1 v50.7,10.2 51.8,11.3 51.8,12.6 53.5,14.3 v54.8,14.3
  Top 0.305: U2.1 65.95,14.95 65.6,15.3 65.6,16.5 65.95,16.85 U2.3 C5.1 | C5.1
  Top 0.406: L1.2 v60.3,4.8 | 54.8,12.9 v54.8,14.3 | U2.1 68.35,14.95 v68.4,14.9
  Bottom 0.2: JP1.7 37.98,21.18 35.3,18.5 35.3,15.6 38.3,12.6 38.3,11.1 39.6,9.8 43.5,9.8 43.6,9.9 50.4,9.9 v50.7,10.2
  Bottom 0.406: v60.3,4.8 65.2,4.8 66.5,6.1 66.5,13 v68.4,14.9 68.3,15 55.5,15 v54.8,14.3
VCC  (via drill 0.3)
  Top 0.2: C9.1 7.35,2.7 U$4.P$1 | U$4.P$2 8.7,5.9 9.9,7.1 16,7.1 18.4,4.7 21.9,4.7 22.2,5 22.2,5.45 R4.2 23.35,5.5 R6.2 23.55,5.55 26.4,8.4 28.95,8.4 C4.2 30.35,7.9 31.7,7.9 32.88,9.08 U1.4 | R23.2 R13.2 50.25,4.25 52,6 v52,7.5 52.23,7.72 IC1.1 | v50.7,11.7 50.7,15.94 50.8,16.04
  Top 0.254: U1.6 34.26,7.96 36.7,10.4 | U1.4 33.11,9.11 34.4,10.4 36.7,10.4 | 36.7,10.4 39.2,12.9 40.2,12.9 40.81,13.51 U1.18 43.38,16.04 R1.2 50.8,16.04 57.26,16.04 58,15.3 58,14.3 59,13.3 64.2,13.3 C1.1 | U$4.P$1 U$4.P$2 | RX1.A 62.4,15.45 C6.1 62.9,14.95 U2.5
  Top 0.305: C1.1 64.37,14.88 U2.5
  Bottom 0.2: v52,7.5 52,10.4 v50.7,11.7

### Text on the board
tPlace: ESP_RST | J1 | J2 | A4 | A5 | ARD | ESP | SW1 | ESP_BL
bPlace: 4 | RX | 5 | TOUT | 16 | VCC | GND | RST | A3 | A2 | A1 | A0 | 13 | 12 | 11 | 10 | ESP_IO | www.protocentral.com | 14 | 2 | 15 | 13 | 12 | ESP_IO | TXO | RXI | GND | 2 | 3 | 4 | 5 | 6 | 7 | 8 | 9